# EAGLE design MotherBoard.ver2.2 (EAGLE 9.6.2)
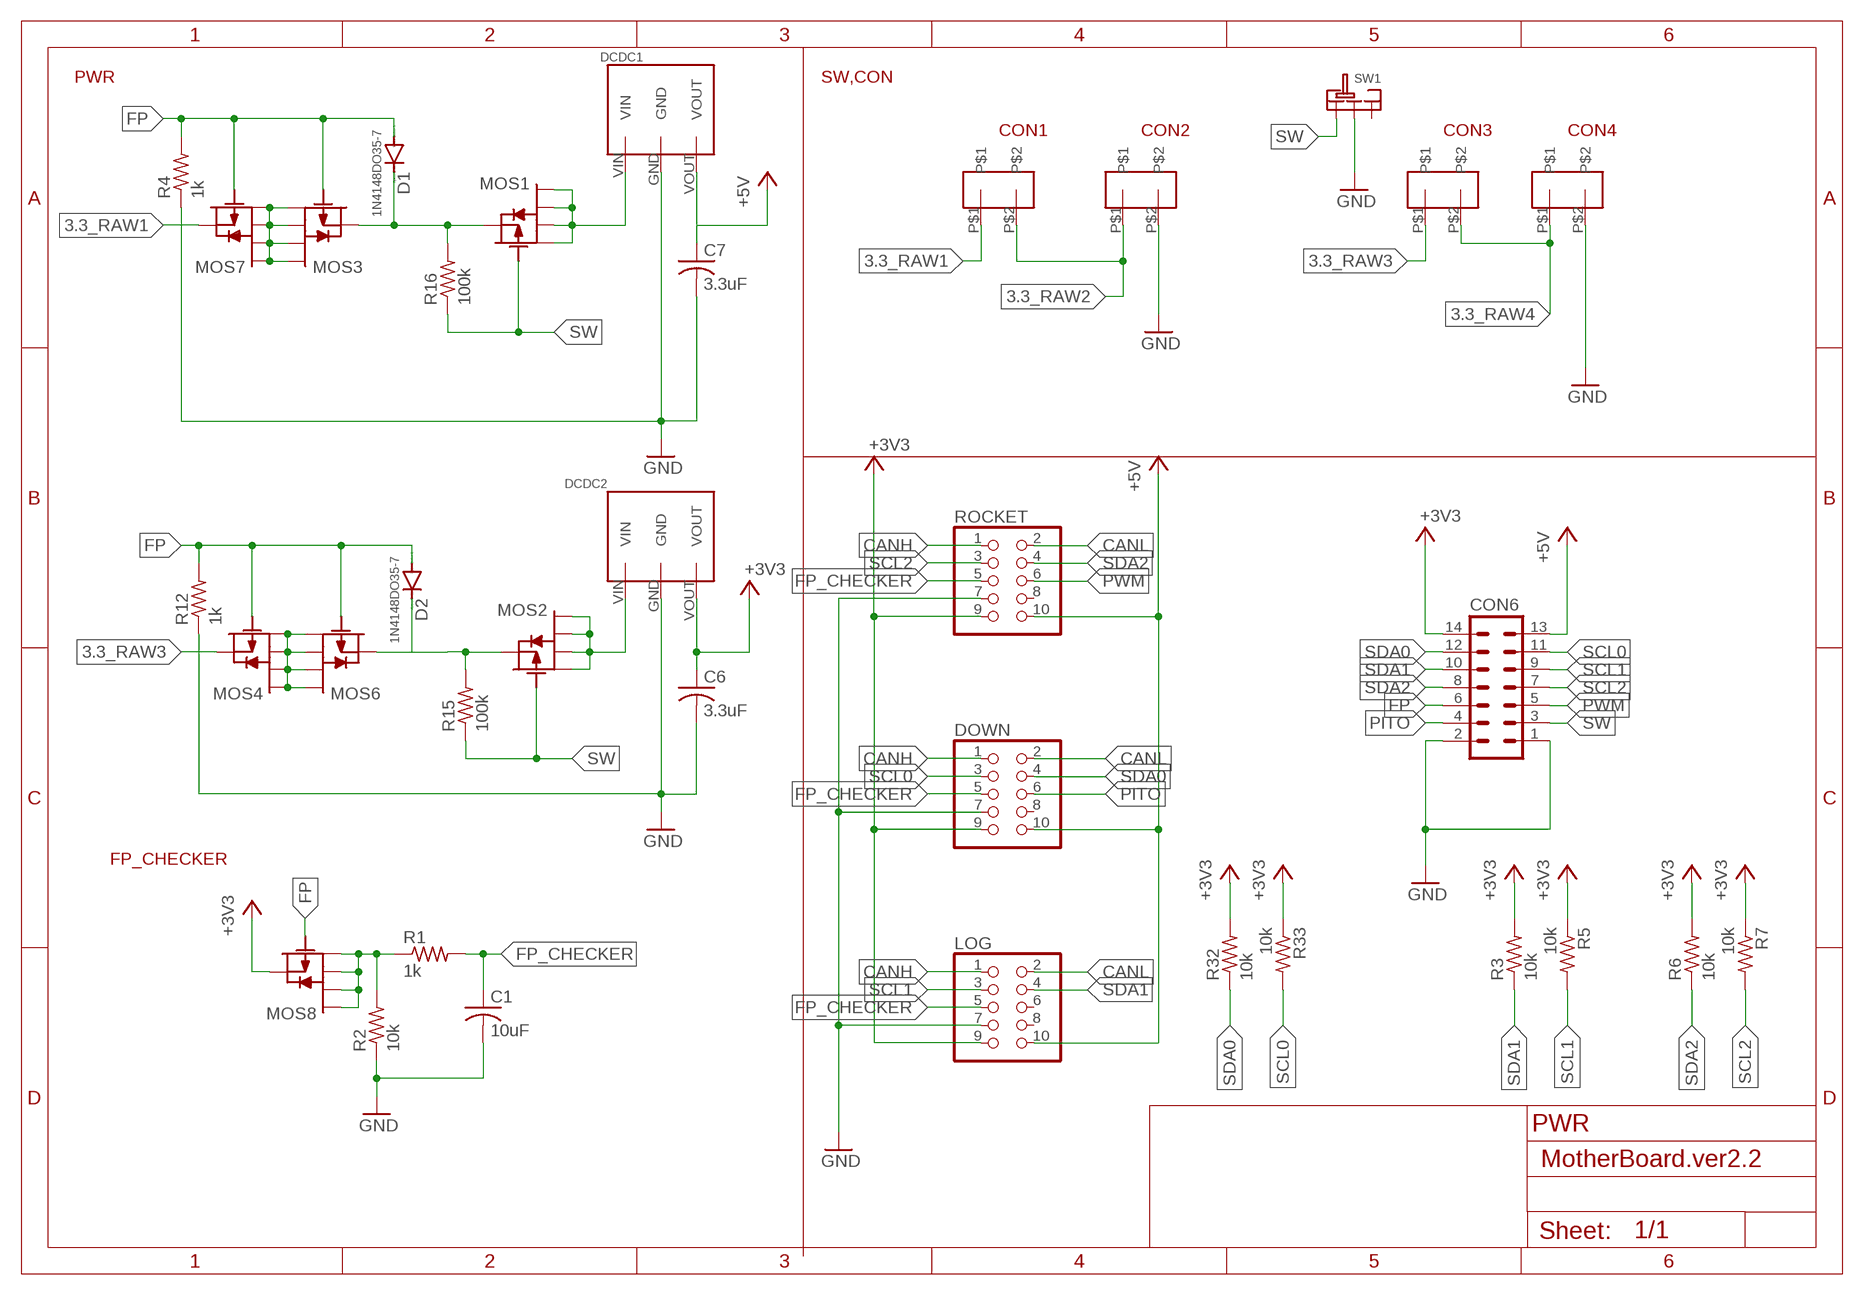
[diagram p0: schematic, sheet 1]

## Parts
C1  10uF  C-USC0603  [C0603]
C6  3.3uF  C-USC0603  [C0603]
C7  3.3uF  C-USC0603  [C0603]
CON1  1.25CON2PIN  [1.25CON2PIN]
CON2  1.25CON2PIN  [1.25CON2PIN]
CON3  1.25CON2PIN  [1.25CON2PIN]
CON4  1.25CON2PIN  [1.25CON2PIN]
CON6  ML14L  [ML14L]
D1  1N4148DO35-7  [DO35-7]
D2  1N4148DO35-7  [DO35-7]
DCDC1  5V1A_M78AR05-1  [5V1A_M78AR05-1]
DCDC2  3.3V1A_M78AR033-1  [3.3V1A_M78AR033-1]
DOWN  PINHD-2X5  [2X05]
LOG  PINHD-2X5  [2X05]
MOS1  PCH_SSM6J808R  [SSM6J808R]
MOS2  PCH_SSM6J808R  [SSM6J808R]
MOS3  PCH_SSM6J808R  [SSM6J808R]
MOS4  PCH_SSM6J808R  [SSM6J808R]
MOS6  PCH_SSM6J808R  [SSM6J808R]
MOS7  PCH_SSM6J808R  [SSM6J808R]
MOS8  PCH_SSM6J808R  [SSM6J808R]
R1  1k  R-US_R0603  [R0603]
R2  10k  R-US_R0603  [R0603]
R3  10k  R-US_R0603  [R0603]
R4  1k  R-US_R0603  [R0603]
R5  10k  R-US_R0603  [R0603]
R6  10k  R-US_R0603  [R0603]
R7  10k  R-US_R0603  [R0603]
R12  1k  R-US_R0603  [R0603]
R15  100k  R-US_R0603  [R0603]
R16  100k  R-US_R0603  [R0603]
R32  10k  R-US_R0603  [R0603]
R33  10k  R-US_R0603  [R0603]
ROCKET  PINHD-2X5  [2X05]
SW1  SRIDE_SWITCH  [SRIDE_SWITCH]

## Nets
3.3_RAW1: CON1.P$1 MOS7.4
3.3_RAW2: CON1.P$2 CON2.P$1
3.3_RAW3: CON3.P$1 MOS4.4
3.3_RAW4: CON3.P$2 CON4.P$1
+3V3: C6.1 CON6.14 DCDC2.VOUT DOWN.9 LOG.9 MOS8.4 R3.2 R5.1 R6.2 R7.1 R32.2 R33.1 ROCKET.9
+5V: C7.1 CON6.13 DCDC1.VOUT DOWN.10 LOG.10 ROCKET.10
+5V1: DCDC1.VIN MOS1.1 MOS1.2 MOS1.5 MOS1.6
CANH: DOWN.1 LOG.1 ROCKET.1
CANL: DOWN.2 LOG.2 ROCKET.2
FP: CON6.6 D1.A D2.A MOS3.3 MOS4.3 MOS6.3 MOS7.3 MOS8.3 R4.2 R12.2
FP_CHECKER: C1.1 DOWN.5 LOG.5 R1.2 ROCKET.5
GND [im]: C1.2 C6.2 C7.2 CON2.P$2 CON4.P$2 CON6.1 CON6.2 DCDC1.GND DCDC2.GND DOWN.7 LOG.7 R2.1 R4.1 R12.1 ROCKET.7 SW1.LR
N$1: MOS8.1 MOS8.2 MOS8.5 MOS8.6 R1.1 R2.2
N$3: D1.C MOS1.4 MOS3.4 R16.2
N$5: D2.C MOS2.4 MOS6.4 R15.2
N$6: MOS4.1 MOS4.2 MOS4.5 MOS4.6 MOS6.1 MOS6.2 MOS6.5 MOS6.6
N$8: DCDC2.VIN MOS2.1 MOS2.2 MOS2.5 MOS2.6
N$12: MOS3.1 MOS3.2 MOS3.5 MOS3.6 MOS7.1 MOS7.2 MOS7.5 MOS7.6
PITO: CON6.4 DOWN.6
PWM: CON6.5 ROCKET.6
SCL0: CON6.11 DOWN.3 R33.2
SCL1: CON6.9 LOG.3 R5.2
SCL2: CON6.7 R7.2 ROCKET.3
SDA0: CON6.12 DOWN.4 R32.1
SDA1: CON6.10 LOG.4 R3.1
SDA2: CON6.8 R6.1 ROCKET.4
SW: CON6.3 MOS1.3 MOS2.3 R15.1 R16.1 SW1.L
Unconnected: DOWN.8 LOG.6 LOG.8 ROCKET.8 SW1.R

## Notes on the sheet
- PWR | SW,CON
- FP_CHECKER
- PWR

## Library data of the parts
C1 C6 C7 = rcl:C-US: CAPACITOR, American symbol; SPICEPREFIX: C
CON1-CON4 = 1.25CON:1.25CON2PIN
CON6 = con-ml:ML14L
D1 D2 = diode:1N4148: DIODE high speed (Philips)
DCDC1 = DC-DC:5V1A_M78AR05-1
DCDC2 = DC-DC:3.3V1A_M78AR033-1
DOWN LOG ROCKET = pinhead:PINHD-2X5: PIN HEADER
MOS1-MOS4 MOS6-MOS8 = Chip MOSFET:PCH_SSM6J808R
R1-R7 R12 R15 R16 R32 R33 = rcl:R-US_: RESISTOR, American symbol; SPICEPREFIX: R
SW1 = Sride Switch:SRIDE_SWITCH

## Net classes
0 default: width 0.406 mm

## Board
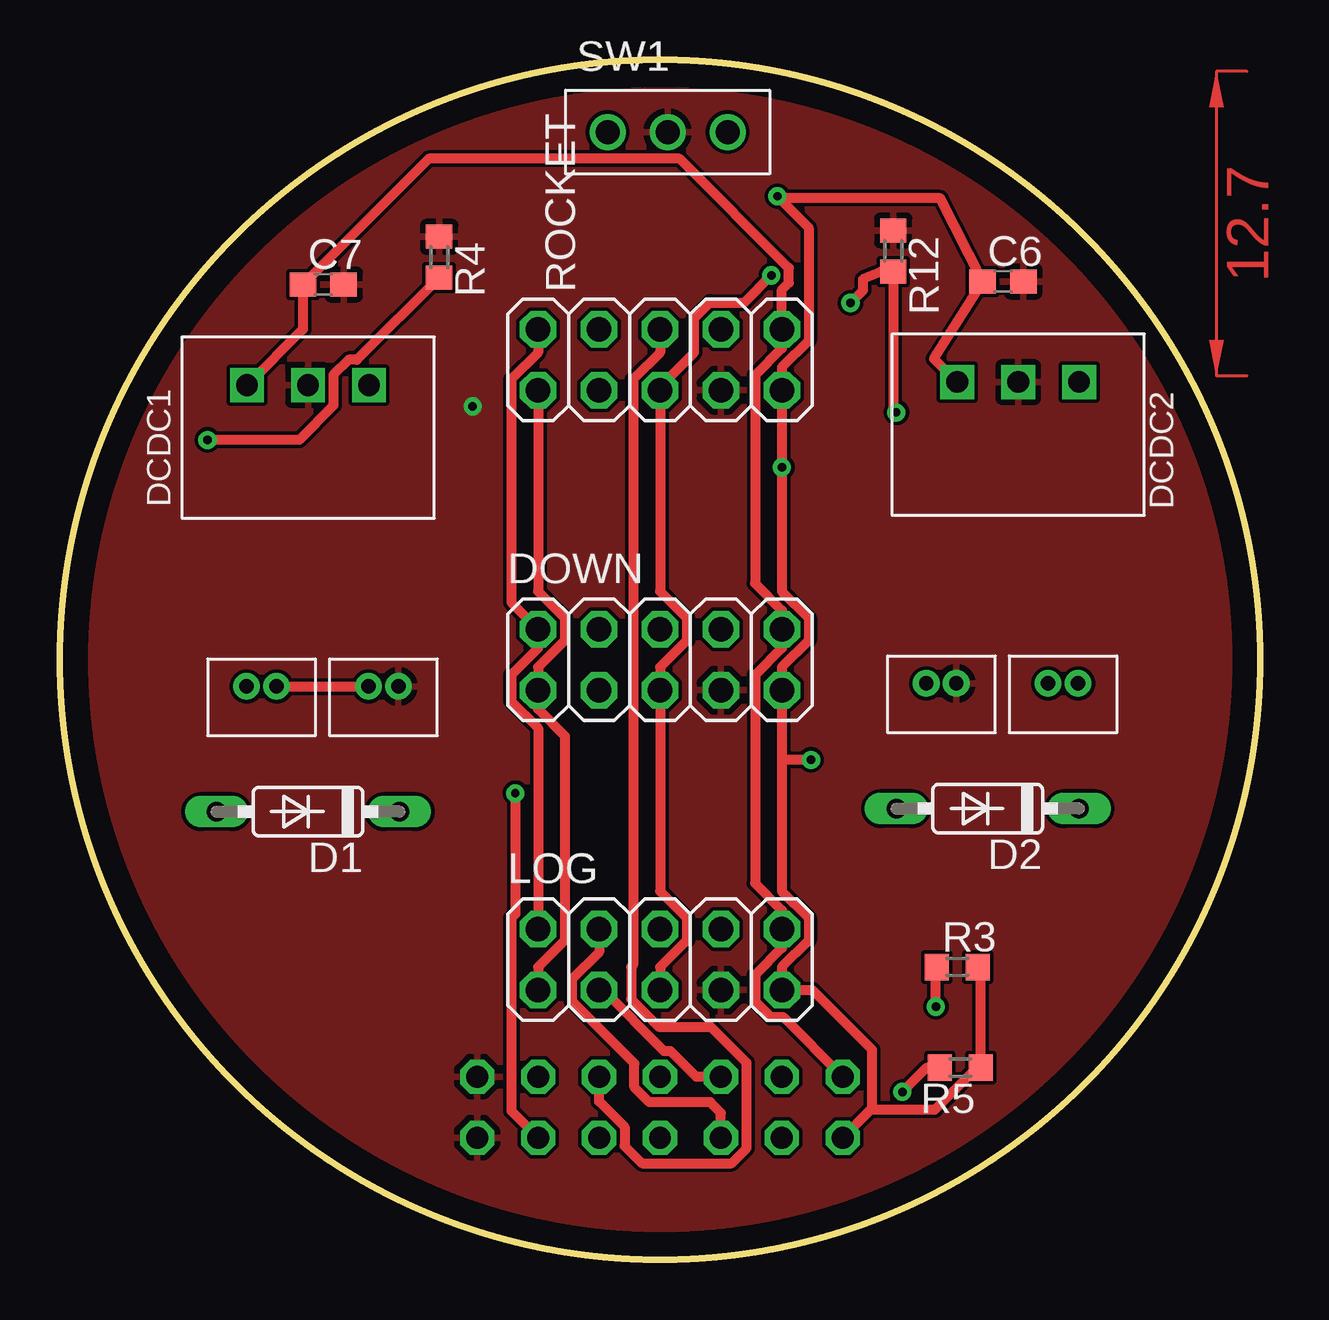
[diagram p1: board, top side]
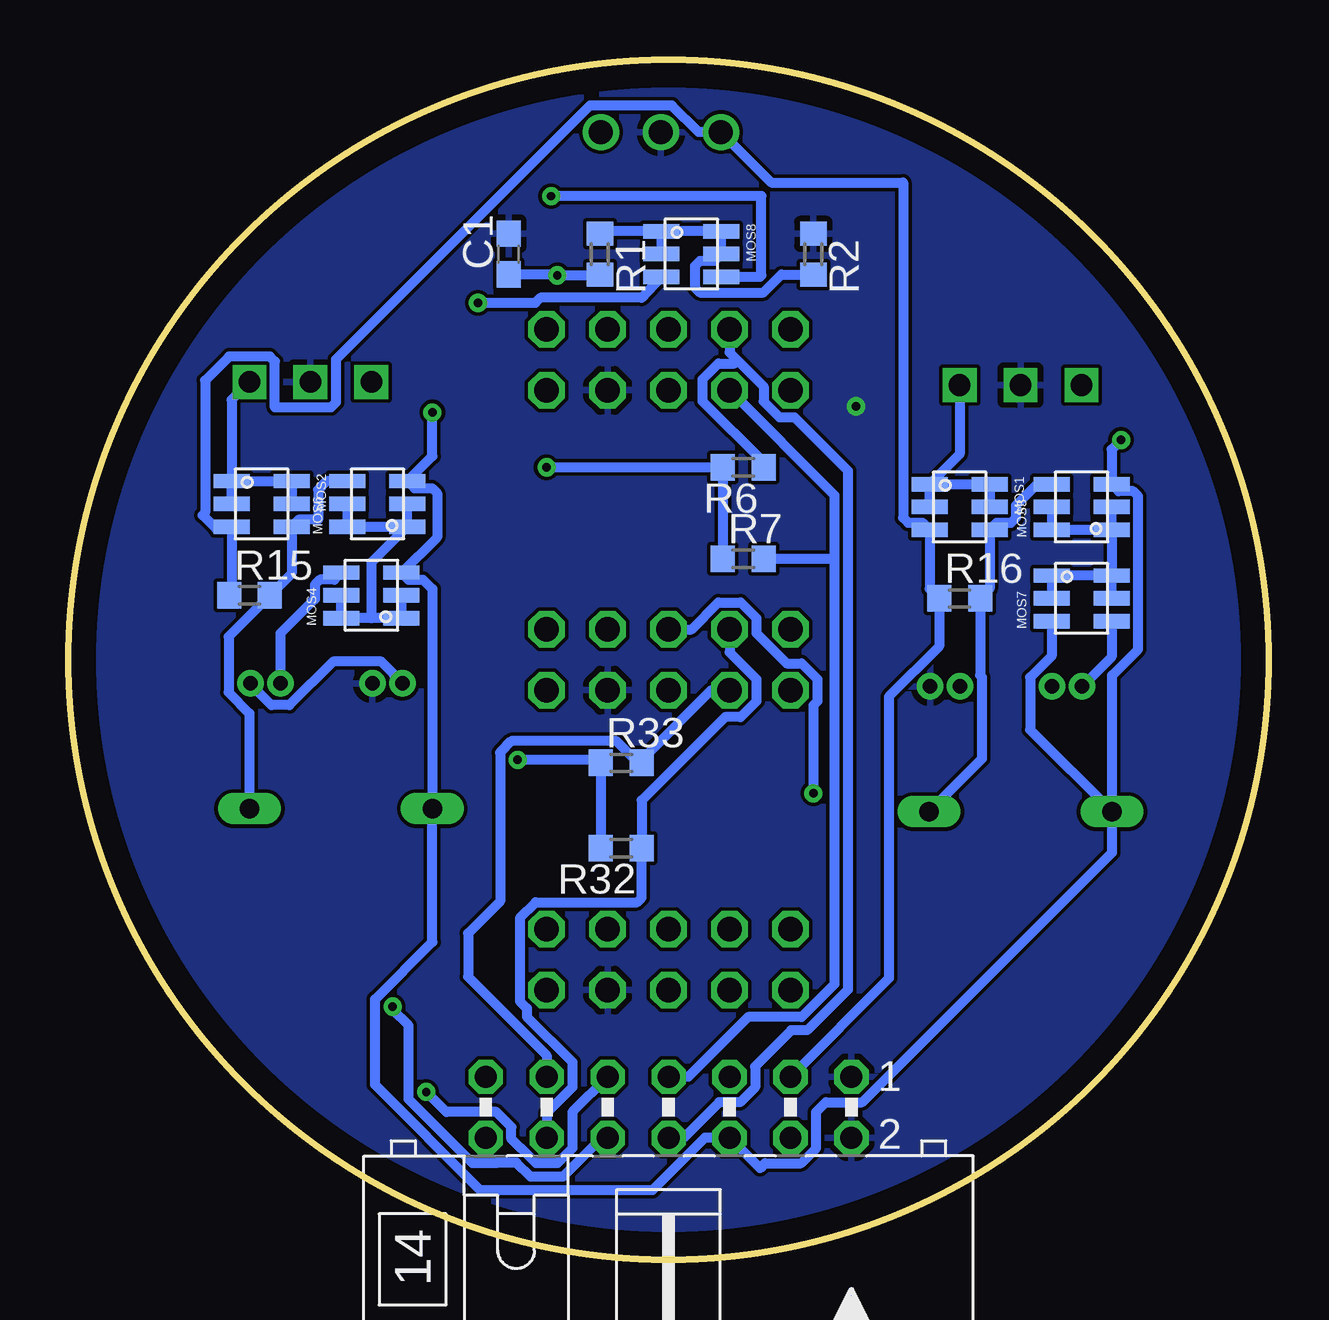
[diagram p2: board, bottom side, seen from below]

Size 50 x 50 mm. Coordinates in mm from the lower left corner, seen from the top.
Outline: circle at 25,25 radius 25
Copper layers (1*16): Top 0.035mm / dielectric 1.5mm / Bottom 0.035mm
Design rules "default": minimum track width 6mil, minimum drill 0.35mm, track to track 6mil, track to pad 6mil, pad to pad 6mil, via to via 6mil, smd to smd 6mil, copper to edge 40mil, drill to drill 6mil, minimum pad ring 10mil, minimum via ring 8mil, stop-mask expansion 4mil, vias tented up to drill 0mil, thermal gap 10mil

### Footprints (pad centres in the part's own frame; a part is rotated, then mirrored left to right if it is on the bottom)
C0603 = smd 1.1 x 1: 1 -0.85,0; 2 0.85,0
1.25CON2PIN = drill 0.6: P$1 1.25,-2.4; P$2 2.5,-2.4
ML14L = drill 0.914 octagon: 1 -7.62,-1.27; 2 -7.62,1.27; 3 -5.08,-1.27; 4 -5.08,1.27; 5 -2.54,-1.27; 6 -2.54,1.27; 7 0,-1.27; 8 0,1.27; 9 2.54,-1.27; 10 2.54,1.27; 11 5.08,-1.27; 12 5.08,1.27; 13 7.62,-1.27; 14 7.62,1.27
DO35-7 = drill 0.813 long: A 3.81,0; C -3.81,0
5V1A_M78AR05-1 = drill 0.9 pad 1.27 square: GND 0,0; VIN 2.54,0; VOUT -2.54,0
3.3V1A_M78AR033-1 = drill 0.9 pad 1.27 square: GND 0,0; VIN 2.54,0; VOUT -2.54,0
2X05 = drill 1.016 octagon: 1 -5.08,-1.27; 2 -5.08,1.27; 3 -2.54,-1.27; 4 -2.54,1.27; 5 0,-1.27; 6 0,1.27; 7 2.54,-1.27; 8 2.54,1.27; 9 5.08,-1.27; 10 5.08,1.27
SSM6J808R = smd 0.6 x 1.5: 1 -0.95,-1.25; 2 0,-1.25; 3 0.95,-1.25; 4 0.95,1.25; 5 0,1.25; 6 -0.95,1.25
R0603 = smd 1 x 1.1: 1 -0.85,0; 2 0.85,0
SRIDE_SWITCH = drill 1: L -2.5,0; LR 0,0; R 2.5,0

### Placement (x,y rotation side)
C1  31.67,41.91 90 bottom
C6  39.29,40.77 0 top
C7  10.97,40.64 0 top
CON1  6.52,26.29 0 top
CON2  11.6,26.29 0 top
CON3  39.92,26.42 0 top
CON4  34.84,26.42 0 top
CON6  25,6.35 180 bottom
D1  10.33,18.67 180 top
D2  38.66,18.8 180 top
DCDC1  10.33,36.45 0 top
DCDC2  39.92,36.58 0 top
DOWN  25,25 0 top
LOG  25,12.5 0 top
MOS1  12.87,31.37 270 bottom
MOS2  41.96,31.5 270 bottom
MOS3  7.79,31.37 90 bottom
MOS4  37.38,27.69 90 bottom
MOS6  37.13,31.5 90 bottom
MOS7  7.79,27.56 270 bottom
MOS8  24.05,41.91 270 bottom
R1  27.86,41.91 270 bottom
R2  18.97,41.91 270 bottom
R3  37.38,12.19 0 top
R4  15.79,41.78 270 top
R5  37.51,8 180 top
R6  21.89,33.02 180 bottom
R7  21.89,29.21 0 bottom
R12  34.72,42.04 270 top
R15  42.47,27.69 0 bottom
R16  12.87,27.56 0 bottom
R32  26.97,17.14 180 bottom
R33  26.97,20.7 0 bottom
ROCKET  25,37.5 0 top
SW1  25.32,46.99 0 top

### Tracks (layer width: path | path; a pad name or v marks a point on that pad's centre or on a via)
3.3_RAW1
  Bottom 0.406: MOS7.4 6.54,25.12 CON1.P$1
3.3_RAW2
  Top 0.406: CON1.P$2 CON2.P$1
3.3_RAW3
  Bottom 0.406: CON3.P$1 41.17,26.1 39.74,27.53 39.74,28.13 39.53,28.34 38.93,28.34 MOS4.4
3.3_RAW4
  Bottom 0.406: CON4.P$1 36.44,24.36 36.44,24.39 36.97,24.93 38.98,24.93 40.8,23.11 41.55,23.11 42.09,23.64 42.09,23.68 CON3.P$2
+3V3  (via drill 0.35)
  Top 0.406: DCDC2.VOUT 36.41,37.55 C6.1 36.68,44.23 29.99,44.23 v29.89,44.32 31.2,43.02 31.2,38.31 30.08,37.19 ROCKET.9 v30.08,33.02 30.08,27.85 31.2,26.73 31.2,25.81 30.08,24.69 DOWN.9 30.08,20.95 | 30.08,20.95 30.08,15.35 31.2,14.23 31.2,13.31 30.08,12.19 LOG.9 31.35,11.23 33.83,8.75 33.83,6.29 CON6.14 33.79,6.25 36.47,6.25 38.22,8 R5.1 38.36,12.06 R3.2 | v31.29,20.83 30.21,20.83 30.08,20.95
  Bottom 0.406: MOS8.4 21.19,40.96 21.13,41.02 21.13,44.32 v29.89,44.32 | v31.29,20.83 27.95,20.83 R33.1 R32.2 | v30.08,33.02 R6.2 R7.1
+5V
  Top 0.406: DCDC1.VOUT 10.12,38.77 C7.1 15.36,45.88 25.82,45.88 30.37,41.33 30.37,40.72 30.08,40.42 ROCKET.10 30.08,37.98 28.96,36.86 28.96,28.18 30.08,27.06 DOWN.10 30.08,25.48 28.96,24.36 28.96,15.68 30.08,14.56 LOG.10 30.08,12.98 28.96,11.86 28.96,10.77 29.62,10.11 30.13,10.11 CON6.13
+5V1
  Bottom 0.406: MOS1.2 MOS1.1 | MOS1.5 MOS1.6 MOS1.1 | DCDC1.VIN 12.87,33.57 MOS1.1
CANH
  Top 0.406: ROCKET.1 19.92,27.85 21.04,26.73 21.04,25.81 19.92,24.69 DOWN.1 19.92,22.94 21.04,21.82 21.04,13.31 19.92,12.19 LOG.1
CANL
  Top 0.406: ROCKET.2 19.92,37.81 18.8,36.69 18.8,27.39 DOWN.2 19.92,25.48 18.8,24.36 18.8,23.27 19.92,22.15 LOG.2
FP  (via drill 0.35)
  Top 0.406: v32.94,39.88 33.45,40.39 33.45,40.85 34.22,41.19 R12.2 34.72,35.43 v34.84,35.31 | R4.2 12.37,37.51 12.02,37.51 11.39,36.88 11.39,35.6 9.96,34.16 v6.14,34.16
  Bottom 0.406: v34.84,35.31 34.84,33.48 MOS6.3 35.59,32.15 34.86,32.15 34.65,31.94 34.65,30.1 36.11,28.64 MOS4.3 35.84,28.34 35.24,28.34 34.84,27.95 D2.A 34.84,13.23 37.23,10.85 37.23,7.29 32.84,2.9 25.68,2.9 23.49,5.08 CON6.6 21.19,3.81 20.99,4.01 19.48,4.01 18.85,4.64 18.85,6.15 18.45,6.55 16.94,6.55 6.52,16.97 D1.A | v32.94,39.88 30.55,39.88 30.34,40.09 26.12,40.09 MOS8.3 | MOS7.3 9.04,25.16 9.93,24.27 9.93,22.08 D1.A | D1.A 6.52,24.35 5.44,25.43 5.44,31.82 5.65,32.02 6.25,32.02 MOS3.3 6.54,33.76 v6.14,34.16
FP_CHECKER  (via drill 0.35)
  Top 0.406: v29.64,41.02 28.5,39.89 27.08,39.89 26.42,39.23 26.42,37.8 25,36.38 ROCKET.5 25,27.85 26.12,26.73 26.12,25.81 25,24.69 DOWN.5 25,15.35 26.12,14.23 26.12,13.31 25,12.19 LOG.5
  Bottom 0.406: R1.2 27.9,41.02 v29.64,41.02 29.68,41.06 C1.1
GND  (via drill 0.35)
  other vias: 17.19,35.56
  pour Top: 5,52.07 46.91,52.07 49.45,49.53 49.45,-3.81 48.18,-5.08 2.46,-5.08 -0.08,-2.54 -0.08,52.07
  pour Bottom: -0.08,52.07 49.45,52.07 50.72,50.8 50.72,-3.81 49.45,-5.08 1.19,-5.08 -0.08,-3.81
N$1
  Bottom 0.406: MOS8.1 27.76,42.86 R1.1 | MOS8.1 MOS8.2 | MOS8.1 MOS8.6 MOS8.5 23.09,41.62 23.7,41.62 23.91,41.41 23.91,40.51 23.7,40.3 21.05,40.3 20.3,41.06 R2.2
N$3
  Bottom 0.406: MOS3.4 9.65,32.32 10.52,31.45 10.52,30.92 10.73,30.71 11.33,30.71 MOS1.4 11.62,27.96 R16.2 12.02,24.34 11.94,24.27 11.94,20.87 D1.C
N$5
  Bottom 0.406: MOS6.4 39.24,32.45 39.6,32.08 39.6,30.84 40.41,30.84 MOS2.4 40.71,28.59 R15.2 43.34,25.97 43.34,23.64 42.47,22.77 D2.C
N$6
  Bottom 0.406: MOS6.5 MOS6.6 MOS6.1 | MOS6.1 MOS6.2 | MOS4.2 MOS4.1 37.38,26.74 | 37.38,26.74 MOS4.6 MOS4.5 | MOS6.1 37.38,29.04 37.38,26.74
N$8
  Bottom 0.406: DCDC2.VIN 43.21,35.83 MOS2.1 | MOS2.1 MOS2.6 MOS2.5 | MOS2.2 MOS2.1
N$12
  Bottom 0.406: MOS3.5 MOS3.6 MOS3.1 | MOS3.1 MOS3.2 | MOS3.1 MOS7.6 | MOS7.6 MOS7.1 MOS7.2 | MOS7.5 MOS7.6
PITO  (via drill 0.35)
  Top 0.406: v18.97,19.43 18.97,14.4 18.8,14.23 18.8,6.2 CON6.4
  Bottom 0.406: DOWN.6 24.04,26.27 22.92,27.39 22,27.39 21.34,26.73 21.34,26.11 20.08,24.85 19.46,24.85 18.8,24.19 18.8,23.27 18.97,23.1 v18.97,19.43
PWM
  Top 0.406: ROCKET.6 25,37.81 23.88,36.69 23.88,12.28 23.8,12.19 23.8,10.85 24.95,9.7 27.11,9.7 28.61,8.2 28.61,4.64 27.98,4.01 24.24,4.01 23.53,4.73 23.53,5.52 22.46,6.59 CON6.5
SCL0
  Bottom 0.406: CON6.11 30.08,8.51 33.36,11.78 33.36,13.6 32.02,14.93 32.02,21.13 31.55,21.61 27.17,21.61 26.27,20.7 R33.2 26.12,20.83 23.22,23.73 DOWN.3
SCL1  (via drill 0.35)
  Top 0.406: v35.1,6.99 36.11,8 R5.2 | LOG.3 22.63,11.23 25.17,8.69 25.44,8.69 26.51,7.62 CON6.9
  Bottom 0.406: CON6.9 29.01,6.15 29.01,4.64 29.64,4.01 30.52,4.01 31.15,4.64 31.16,4.64 31.55,5.03 31.55,5.52 32.18,6.15 34.26,6.15 v35.1,6.99
SCL2
  Bottom 0.406: ROCKET.3 18.09,31.86 18.09,29.21 | CON6.7 24.18,7.62 21.68,10.11 19.46,10.11 18.09,11.48 18.09,29.21 | R7.2 18.09,29.21
SDA0
  Bottom 0.406: DOWN.4 22.46,25.31 21.34,24.19 21.34,23.27 22,22.61 22.65,22.61 26.12,19.14 R32.1 26.12,15.07 26.31,14.89 30.54,14.89 31.2,14.23 31.2,10.77 30.91,10.48 30.91,10.12 29.01,8.23 29.01,7.18 30.08,6.11 CON6.12
SDA1  (via drill 0.35)
  Top 0.406: CON6.10 27.54,6.11 27.1,6.55 24.56,6.55 23.93,7.18 23.93,8.18 21.34,10.77 21.34,11.69 22.46,12.81 LOG.4 | v36.5,10.54 36.5,12.15 R3.1
  Bottom 0.406: v36.5,10.54 36.5,10.41 35.83,9.75 35.83,7.11 35.83,6.68 33.16,4.01 32.18,4.01 32.15,4.04 31.34,4.04 30.75,3.45 29.41,3.45 27.78,5.08 CON6.10
SDA2
  Bottom 0.406: ROCKET.4 22.46,37.81 22.13,37.48 | 22.13,37.48 21.04,36.39 21.04,35.77 20.38,35.11 19.76,35.11 17.53,32.88 17.53,11.25 19.23,9.55 19.89,9.55 21.39,8.05 21.39,7.18 22.02,6.55 22.89,6.55 24.36,5.08 CON6.8 | 22.13,37.48 22.26,37.35 22.92,37.35 23.58,36.69 23.58,35.77 21.04,33.23 R6.1
SW
  Bottom 0.406: R15.1 43.21,27.79 MOS2.3 43.29,30.46 43.85,30.46 44.42,31.02 44.31,31.13 44.31,36.64 43.32,37.64 41.61,37.64 41.41,37.43 41.41,35.52 39.07,35.52 38.87,35.73 38.87,37.51 28.28,48.1 24.86,48.1 23.75,46.99 SW1.L 20.72,44.89 15.23,44.89 15.23,30.92 15.02,30.71 14.42,30.71 MOS1.3 14.12,27.96 R16.1 13.72,25.55 15.82,23.46 15.82,11.72 CON6.3
(copper drawn outside any net)
  shapes: Top area x2